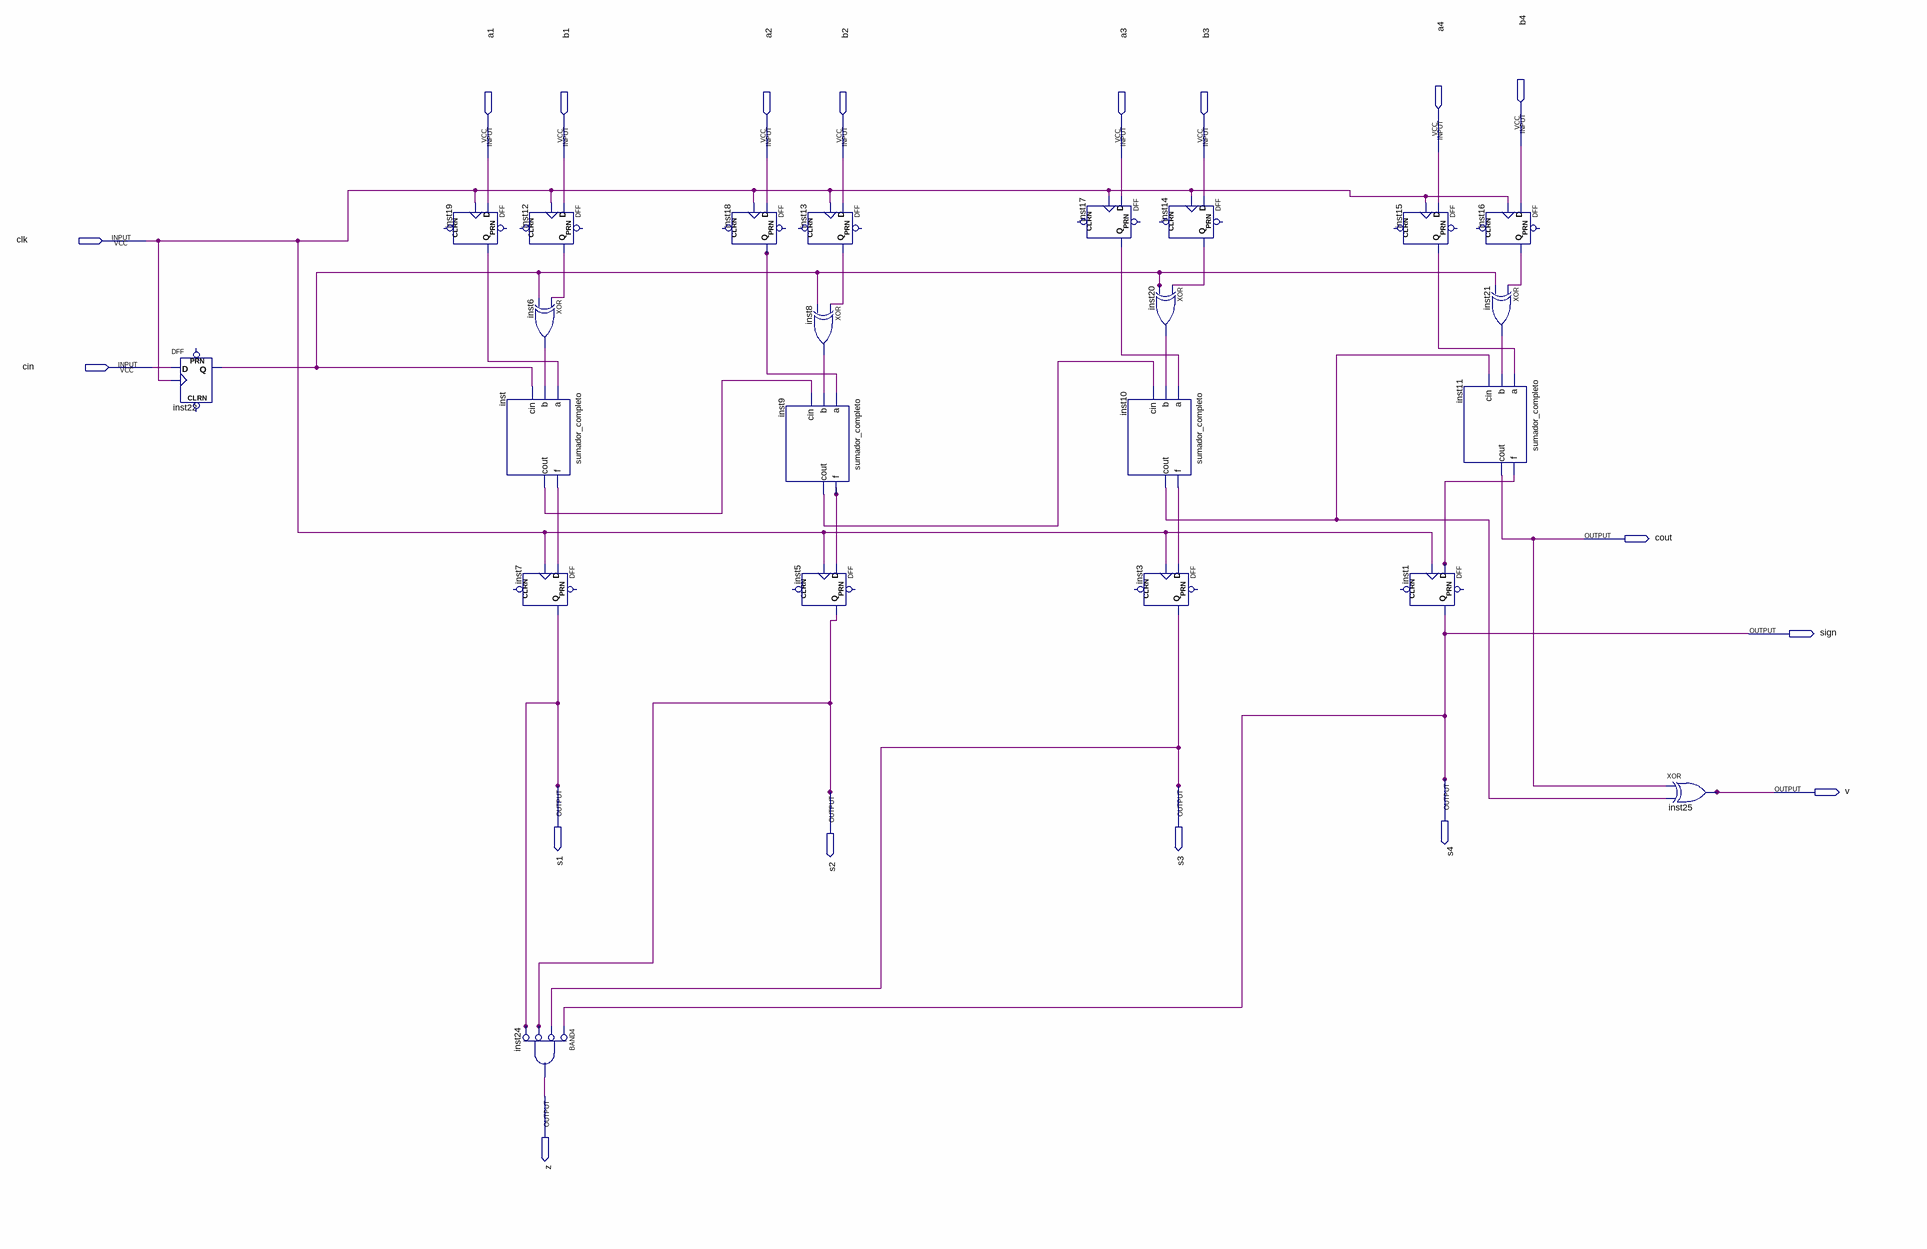
[diagram p0: schematic sheet]
// Quartus schematic esquematico.bdf as structural Verilog: 23 symbols, 18 pins
module esquematico (
  input  b4,
  input  a4,
  input  a1,
  input  b1,
  input  a2,
  input  b2,
  input  a3,
  input  b3,
  input  clk,
  input  cin,
  output cout,
  output sign,
  output s4,
  output s1,
  output s3,
  output s2,
  output v,
  output z
);

  wire inst6_out, inst8_out, inst9_cout, inst9_f, inst10_cout, inst10_f, inst11_f, inst12_q, inst13_q,
       inst14_q, inst15_q, inst16_q, inst17_q, inst18_q, inst19_q, inst20_out, inst21_out, inst22_q,
       inst_cout, inst_f;

  DFF inst22 (.CLK(clk), .D(cin), .Q(inst22_q));  // open: CLRN, PRN
  DFF inst19 (.CLK(clk), .D(a1), .Q(inst19_q));  // open: CLRN, PRN
  DFF inst12 (.CLK(clk), .D(b1), .Q(inst12_q));  // open: CLRN, PRN
  xor inst6 (inst6_out, inst12_q, inst22_q);
  sumador_completo inst (.a(inst19_q), .b(inst6_out), .cin(inst22_q), .f(inst_f), .cout(inst_cout));
  DFF inst7 (.CLK(clk), .D(inst_f), .Q(s1));  // open: CLRN, PRN
  and inst24 (z, ~s4, ~s3, ~s2, ~s1);  // BAND4
  DFF inst18 (.CLK(clk), .D(a2), .Q(inst18_q));  // open: CLRN, PRN
  sumador_completo inst9 (.a(inst18_q), .b(inst8_out), .cin(inst_cout), .f(inst9_f), .cout(inst9_cout));
  DFF inst5 (.CLK(clk), .D(inst9_f), .Q(s2));  // open: CLRN, PRN
  DFF inst13 (.CLK(clk), .D(b2), .Q(inst13_q));  // open: CLRN, PRN
  xor inst8 (inst8_out, inst13_q, inst22_q);
  DFF inst17 (.CLK(clk), .D(a3), .Q(inst17_q));  // open: CLRN, PRN
  xor inst20 (inst20_out, inst14_q, inst22_q);
  sumador_completo inst10 (.a(inst17_q), .b(inst20_out), .cin(inst9_cout), .f(inst10_f), .cout(inst10_cout));
  DFF inst3 (.CLK(clk), .D(inst10_f), .Q(s3));  // open: CLRN, PRN
  DFF inst14 (.CLK(clk), .D(b3), .Q(inst14_q));  // open: CLRN, PRN
  DFF inst15 (.CLK(clk), .D(a4), .Q(inst15_q));  // open: CLRN, PRN
  DFF inst1 (.CLK(clk), .D(inst11_f), .Q(s4));  // open: CLRN, PRN
  sumador_completo inst11 (.a(inst15_q), .b(inst21_out), .cin(inst10_cout), .f(inst11_f), .cout(cout));
  DFF inst16 (.CLK(clk), .D(b4), .Q(inst16_q));  // open: CLRN, PRN
  xor inst21 (inst21_out, inst16_q, inst22_q);
  xor inst25 (v, cout, inst10_cout);

  assign sign = s4;
endmodule
